# EAGLE design aufgeblasen-wurst (EAGLE 6.3)
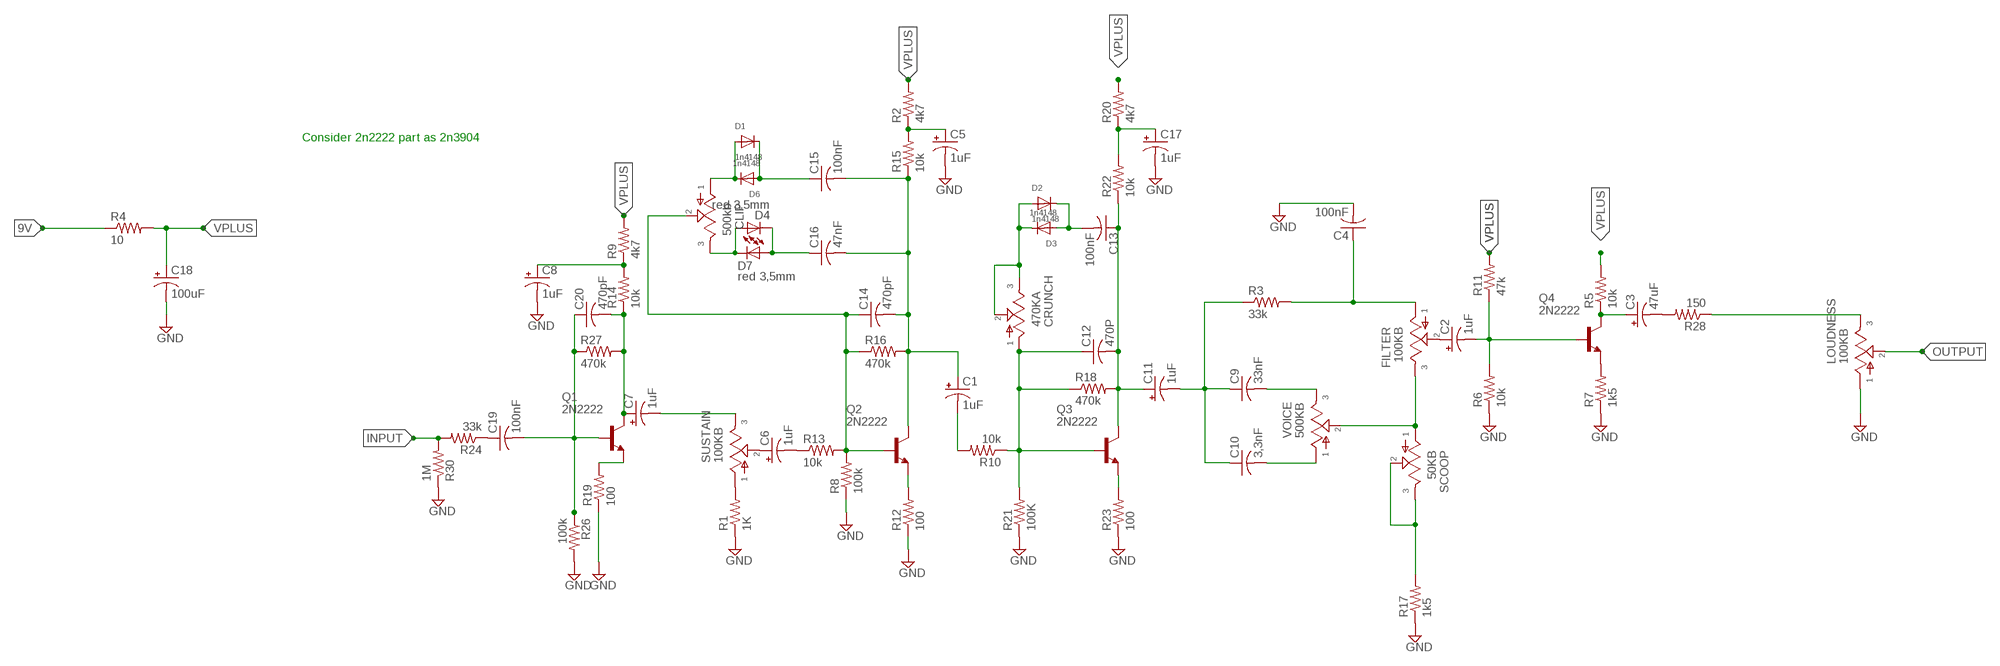
[diagram p0: schematic, sheet 1]

## Parts
C1  1uF  CPOL-USTT2D5  [TT2D5]
C2  1uF  CPOL-USTT2D5  [TT2D5]
C3  47uF  CPOL-USTT2D5  [TT2D5]
C4  100nF  C-US050-025X075  [C050-025X075]
C5  1uF  CPOL-USTT2D5  [TT2D5]
C6  1uF  CPOL-USTT2D5  [TT2D5]
C7  1uF  CPOL-USTT2D5  [TT2D5]
C8  1uF  CPOL-USTT2D5  [TT2D5]
C9  33nF  C-US050-025X075  [C050-025X075]
C10  3,3nF  C-US050-025X075  [C050-025X075]
C11  1uF  CPOL-USTT2D5  [TT2D5]
C12  470P  C-US050-025X075  [C050-025X075]
C13  100nF  C-US050-025X075  [C050-025X075]
C14  470pF  C-US050-025X075  [C050-025X075]
C15  100nF  C-US050-025X075  [C050-025X075]
C16  47nF  C-US050-025X075  [C050-025X075]
C17  1uF  CPOL-USTT2D5  [TT2D5]
C18  100uF  CPOL-USTT2D5  [TT2D5]
C19  100nF  C-US050-025X075  [C050-025X075]
C20  470pF  C-US050-025X075  [C050-025X075]
CLIP  500kb  POT  [POT]
CRUNCH  470KA  POT  [POT]
D1  1n4148  DIODEDO-1N4148  [DO-1N4148]
D2  1n4148  DIODEDO-1N4148  [DO-1N4148]
D3  1n4148  DIODEDO-1N4148  [DO-1N4148]
D4  red 3,5mm  LED3MM  [LED3MM]
D6  1n4148  DIODEDO-1N4148  [DO-1N4148]
D7  red 3,5mm  LED3MM  [LED3MM]
FILTER  100KB  POT  [POT]
LOUDNESS  100KB  POT  [POT]
Q1  2N2222  [TO92-EBC-OVAL]
Q2  2N2222  [TO92-EBC-OVAL]
Q3  2N2222  [TO92-EBC-OVAL]
Q4  2N2222  [TO92-EBC-OVAL]
R1  1K  R-US_0207/7  [0207/7]
R2  4k7  R-US_0207/7  [0207/7]
R3  33k  R-US_0207/7  [0207/7]
R4  10  R-US_0207/7  [0207/7]
R5  10k  R-US_0207/7  [0207/7]
R6  10k  R-US_0207/7  [0207/7]
R7  1k5  R-US_0207/7  [0207/7]
R8  100k  R-US_0207/7  [0207/7]
R9  4k7  R-US_0207/7  [0207/7]
R10  10k  R-US_0207/7  [0207/7]
R11  47k  R-US_0207/7  [0207/7]
R12  100  R-US_0207/7  [0207/7]
R13  10k  R-US_0207/7  [0207/7]
R14  10k  R-US_0207/7  [0207/7]
R15  10k  R-US_0207/7  [0207/7]
R16  470k  R-US_0207/7  [0207/7]
R17  1k5  R-US_0207/7  [0207/7]
R18  470k  R-US_0207/7  [0207/7]
R19  100  R-US_0207/7  [0207/7]
R20  4k7  R-US_0207/7  [0207/7]
R21  100K  R-US_0207/7  [0207/7]
R22  10k  R-US_0207/7  [0207/7]
R23  100  R-US_0207/7  [0207/7]
R24  33k  R-US_0207/7  [0207/7]
R26  100k  R-US_0207/7  [0207/7]
R27  470k  R-US_0207/7  [0207/7]
R28  150  R-US_0207/7  [0207/7]
R30  1M  R-US_0207/7  [0207/7]
SCOOP  50KB  POT  [POT]
SUSTAIN  100KB  POT  [POT]
VOICE  500KB  POT  [POT]

## Nets
9V: R4.1
GND: C4.2 C5.- C8.- C17.- C18.- LOUDNESS.1 R1.1 R6.1 R7.1 R8.1 R12.1 R17.1 R19.1 R21.1 R23.1 R26.2 R30.1
INPUT: R24.2 R30.2
JUMP1: LOUDNESS.3 R28.1
JUMP3: C14.1 CLIP.2 Q2.B R8.2 R13.2 R16.1
N$1: C19.2 C20.1 Q1.B R26.1 R27.1
N$2: C19.1 R24.1
N$3: Q1.E R19.2
N$4: C6.+ SUSTAIN.2
N$5: C7.- SUSTAIN.3
N$6: R1.2 SUSTAIN.1
N$7: C2.+ FILTER.2
N$8: C6.- R13.1
N$10: Q2.E R12.2
N$11: C1.+ C14.2 C15.2 C16.2 Q2.C R15.1 R16.2
N$12: CLIP.3 D4.A D7.K(C)
N$13: C8.+ R9.1 R14.2
N$14: C16.1 D4.K(C) D7.A
N$15: C15.1 D1.C D6.A
N$16: CLIP.1 D1.A D6.C
N$17: C5.+ R2.1 R15.2
N$18: C1.- R10.2
N$19: C11.+ C12.2 C13.1 Q3.C R18.2 R22.1
N$20: C12.1 CRUNCH.1 Q3.B R10.1 R18.1 R21.2
N$21: Q3.E R23.2
N$22: CRUNCH.2 CRUNCH.3 D2.A D3.C
N$23: C13.2 D2.C D3.A
N$24: C17.+ R20.1 R22.2
N$25: C9.1 C10.1 C11.- R3.1
N$26: C10.2 VOICE.1
N$27: C4.1 FILTER.1 R3.2
N$28: C9.2 VOICE.3
N$29: FILTER.3 SCOOP.1 VOICE.2
N$30: R17.2 SCOOP.2 SCOOP.3
N$32: C2.- Q4.B R6.2 R11.1
N$33: C3.+ Q4.C R5.1
N$34: Q4.E R7.2
N$35: C7.+ C20.2 Q1.C R14.1 R27.2
N$36: C3.- R28.2
OUTPUT: LOUDNESS.2
VPLUS: C18.+ R2.2 R4.2 R5.2 R9.2 R11.2 R20.2

## Notes on the sheet
- Consider 2n2222 part as 2n3904

## Library data of the parts
C1-C3 C5-C8 C11 C17 C18 = adafruit:CPOL-US: POLARIZED CAPACITOR, American symbol
C4 C9 C10 C12-C16 C19 C20 = adafruit:C-US: CAPACITOR, American symbol
CLIP CRUNCH FILTER LOUDNESS SCOOP SUSTAIN VOICE = gm-pots:POT: Potentiometers the arrow indicates the clockwise motion of th wiper (lug 2) fully counter clockwise there is no resistance between lugs 1 and 2 fully clockwise the resistance between lugs 1 and 2 is the value of the pot
D1-D3 D6 = adafruit:DIODE: Diode SMADIODE - SMA Surface Mount Package 20V 1A Schottky Diode Digikey: 641-1014-6-ND DO-1N4148 - Through Hole Small Current Diode SOD-123 20V 1 A (.5mV Vf) Schottky Diode - Digikey: MBRX120TPMSCT-ND SOD-323 10V 570mA (.38mV Vf, 3ns) Schottky Diode - Digikey: ZLLS410CT-ND SOD-523 30V 30mA Schottky Diode (RB751S-40TE61) - Digikey: RB751S-40TE61CT-ND SOT23-R/W - SOT23 Package (R = Solder Paste/Reflow Ovens, W = Hand-Soldering) BAT54Film 40V 300mA - Digikey: 497-7162-1-ND
D4 D7 = adafruit:LED: LED OSRAM: - CHIPLED LG R971, LG N971, LY N971, LG Q971, LY Q971, LO R971, LY R971 LH N974, LH R974 LS Q976, LO Q976, LY Q976 LO Q996 - Hyper CHIPLED LW Q18S LB Q993, LB Q99A, LB R99A - SideLED LS A670, LO A670, LY A670, LG A670, LP A670 LB A673, LV A673, LT A673, LW A673 LH A674 LY A675 LS A676, LA A676, LO A676, LY A676, LW A676 LS A679, LY A679, LG A679 - Hyper Micro SIDELED® LS Y876, LA Y876, LO Y876, LY Y876 LT Y87S - SmartLED LW L88C, LW L88S LB L89C, LB L89S, LG L890 LS L89K, LO L89K, LY L89K LS L896, LA L896, LO L896, LY L896 - TOPLED LS T670, LO T670, LY T670, LG T670, LP T670 LSG T670, LSP T670, LSY T670, LOP T670, LYG T670 LG T671, LOG T671, LSG T671 LB T673, LV T673, LT T673, LW T673 LH T674 LS T676, LA T676, LO T676, LY T676, LB T676, LH T676, LSB T676, LW T676 LB T67C, LV T67C, LT T67C, LS T67K, LO T67K, LY T67K, LW E67C LS E67B, LA E67B, LO E67B, LY E67B, LB E67C, LV E67C, LT E67C LW T67C LS T679, LY T679, LG T679 LS T770, LO T770, LY T770, LG T770, LP T770 LB T773, LV T773, LT T773, LW T773 LH T774 LS E675, LA E675, LY E675, LS T675 LS T776, LA T776, LO T776, LY T776, LB T776 LHGB T686 LT T68C, LB T68C - Hyper Mini TOPLED® LB M676 - Mini TOPLED Santana® LG M470 LS M47K, LO M47K, LY M47K Source: http://www.osram.convergy.de/
Q1-Q4 = adafruit:2N2222: NPN TRANSISTOR Big oval pads
R1-R24 R26-R28 R30 = rcl:R-US_: RESISTOR, American symbol

## Board
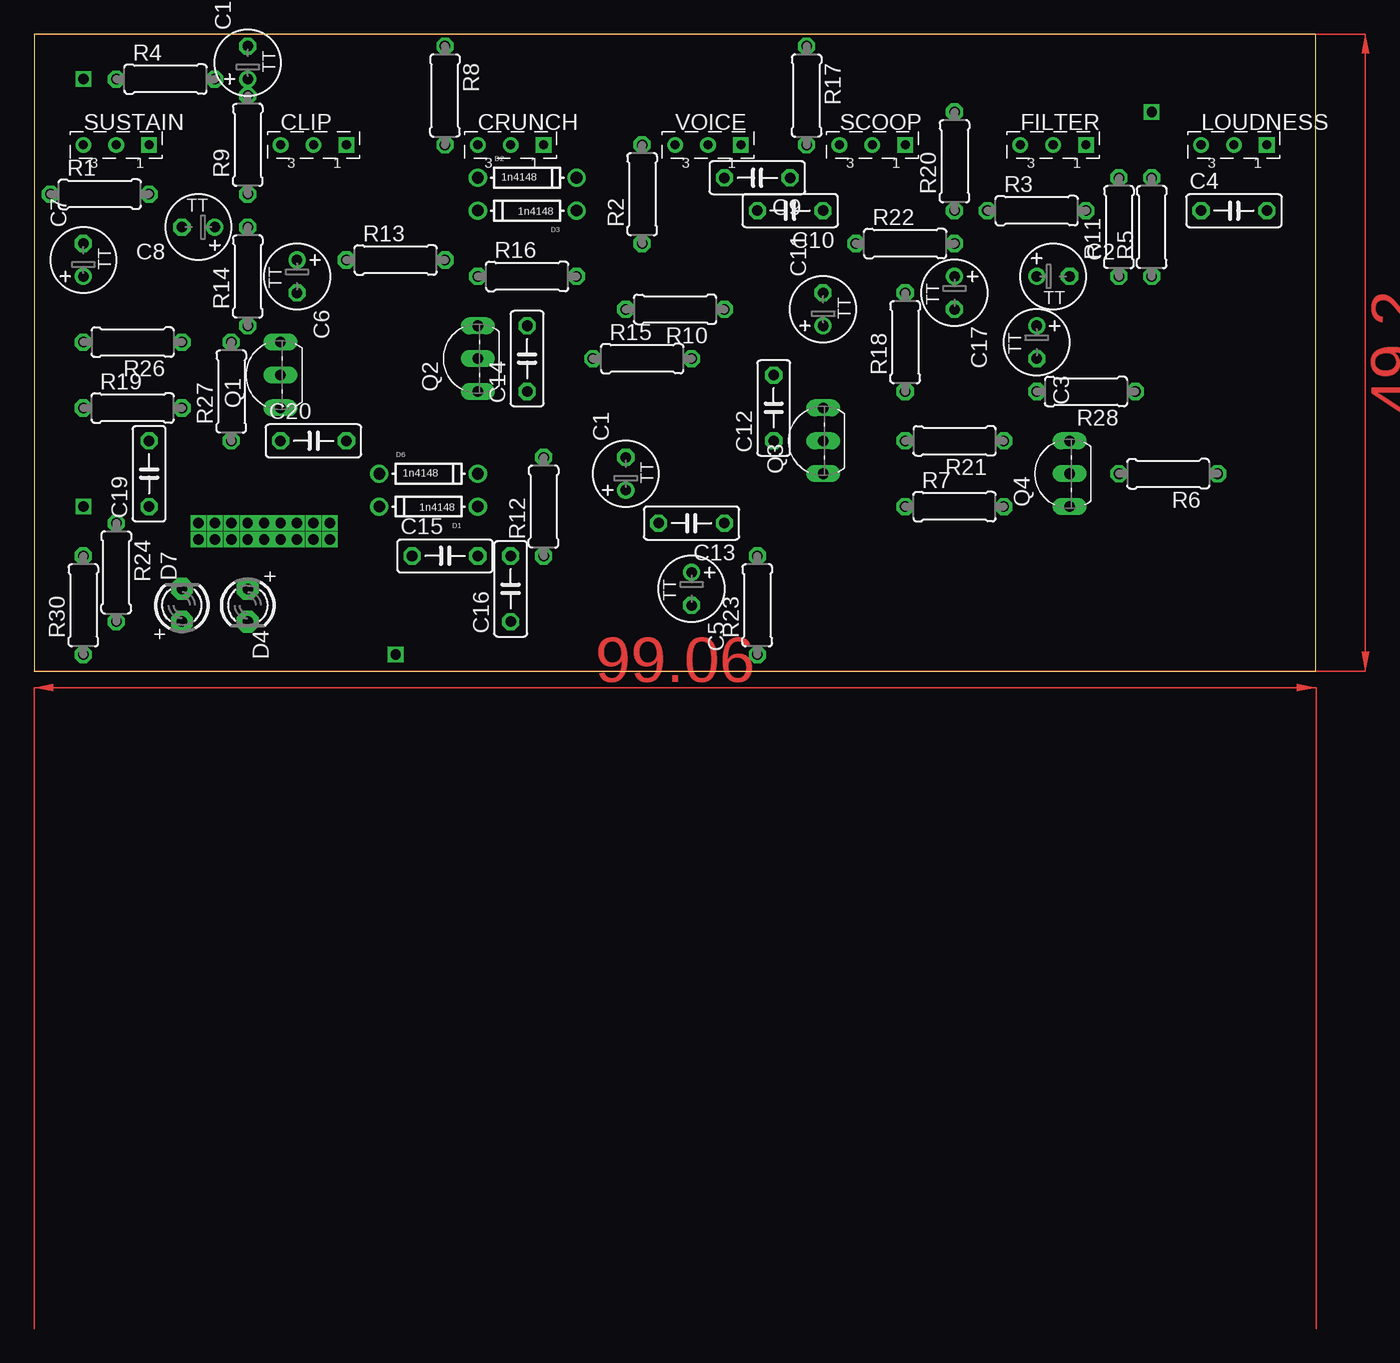
[diagram p1: board, top side]
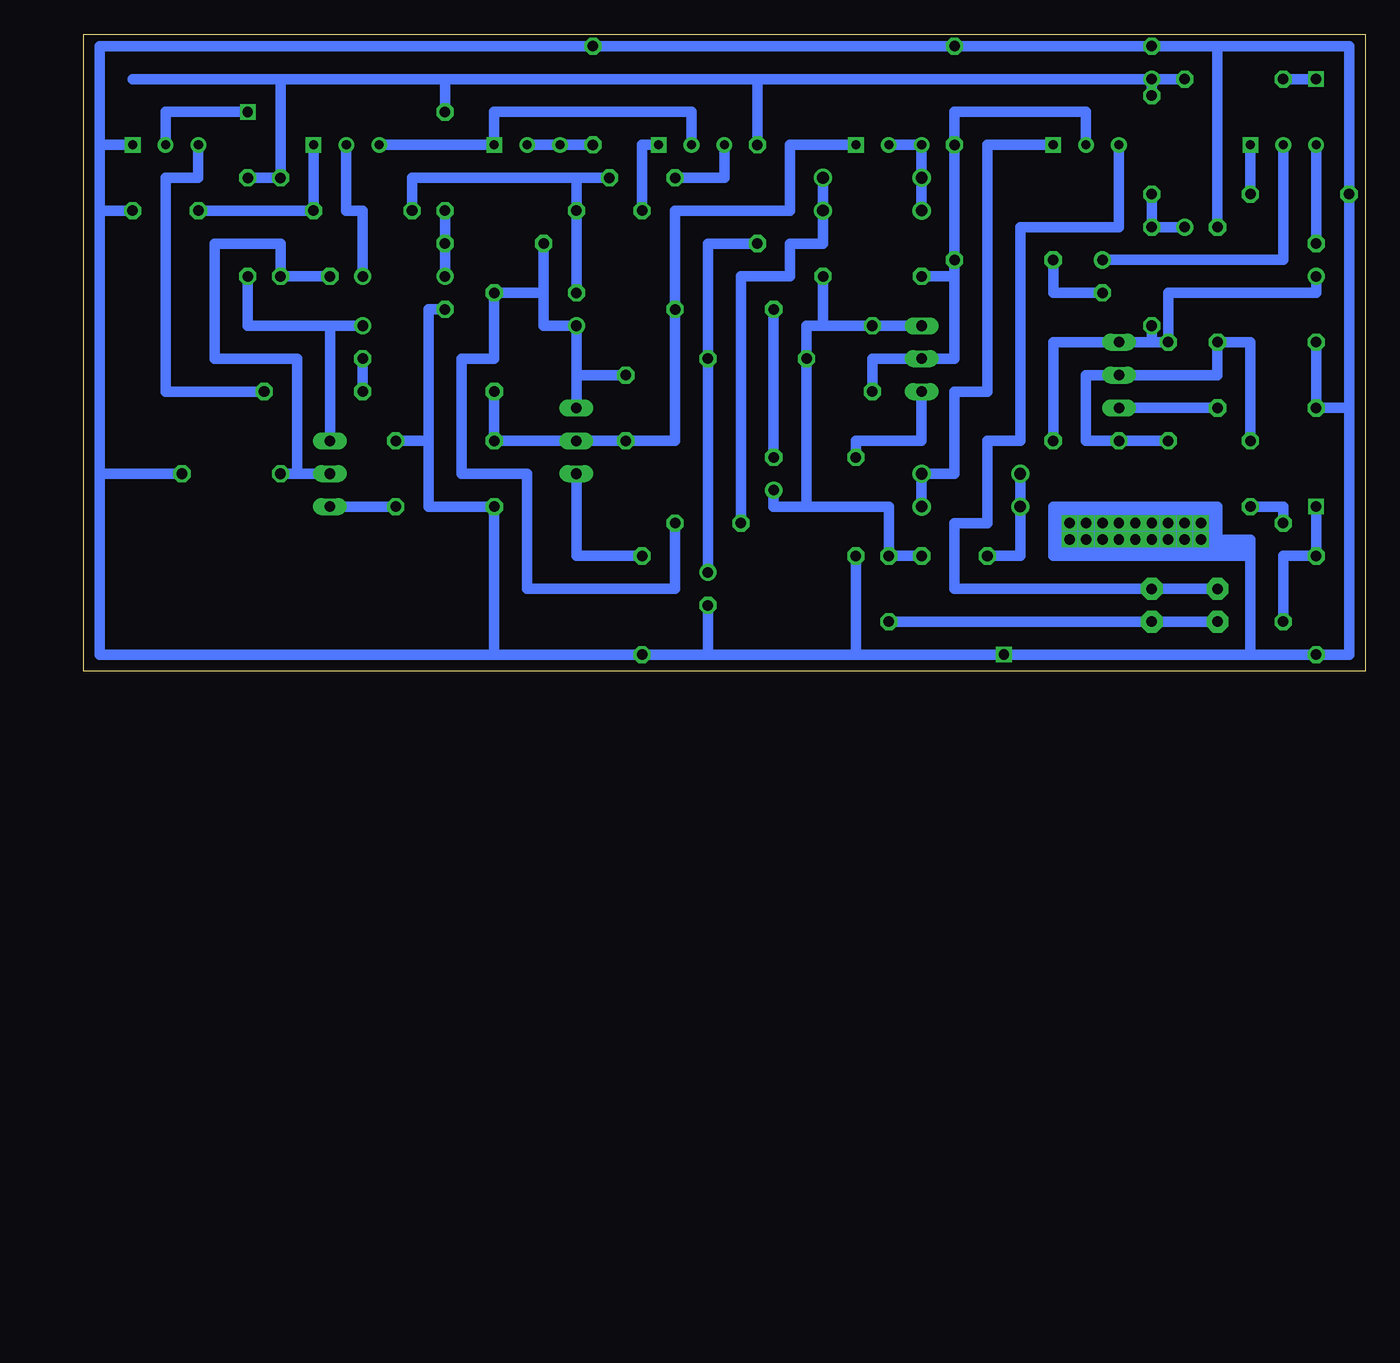
[diagram p2: board, bottom side, seen from below]

Size 99.04 x 49.2 mm. Coordinates in mm from the lower left corner, seen from the top.
Outline: 0,0 99.04,0 99.04,49.2 0,49.2 0,0
Copper layers (1*16): Top 0.035mm / dielectric 1.5mm / Bottom 0.035mm
Design rules "default": minimum track width 10mil, minimum drill 24mil, track to track 8mil, track to pad 8mil, pad to pad 8mil, via to via 8mil, smd to smd 8mil, copper to edge 40mil, drill to drill 8mil, minimum pad ring 10mil, minimum via ring 8mil, stop-mask expansion 4mil, vias tented up to drill 0mil, thermal gap 10mil

### Footprints (pad centres in the part's own frame; a part is rotated, then mirrored left to right if it is on the bottom)
TT2D5 = drill 0.813: + -1.27,0 | drill 0.813 octagon: - 1.27,0
C050-025X075 = drill 0.813 octagon: 1 -2.54,0; 2 2.54,0
POT = drill 0.7 square: 1 2.54,0 | drill 0.7: 2 0,0; 3 -2.54,0
DO-1N4148 = drill 0.9: A -3.81,0; C 3.81,0
LED3MM = drill 0.813 pad 1.676 octagon: A -1.27,0; K 1.27,0
TO92-EBC-OVAL = drill 0.813 long: B 0,-1.27; C 2.54,-1.27; E -2.54,-1.27
0207/7 = drill 0.813 octagon: 1 -3.81,0; 2 3.81,0

### Placement (x,y rotation side)
C1  45.72,15.24 90 top
C2  78.74,30.48 0 top
C3  77.47,25.4 270 top
C4  92.71,35.56 0 top
C5  50.8,6.35 270 top
C6  20.32,30.48 270 top
C7  3.81,31.75 90 top
C8  12.7,34.29 180 top
C9  55.88,38.1 180 top
C10  58.42,35.56 180 top
C11  60.96,27.94 90 top
C12  57.15,20.32 90 top
C13  50.8,11.43 180 top
C14  38.1,24.13 90 top
C15  31.75,8.89 0 top
C16  36.83,6.35 90 top
C17  71.12,29.21 270 top
C18  16.51,46.99 90 top
C19  8.89,15.24 90 top
C20  21.59,17.78 0 top
CLIP  21.59,40.64 0 top
CRUNCH  36.83,40.64 0 top
D1  30.48,12.7 180 top
D2  38.1,38.1 0 top
D3  38.1,35.56 180 top
D4  16.51,5.08 270 top
D6  30.48,15.24 0 top
D7  11.43,5.08 90 top
FILTER  78.74,40.64 0 top
LOUDNESS  92.71,40.64 0 top
Q1  17.78,22.86 90 top
Q2  33.02,24.13 90 top
Q3  59.69,17.78 90 top
Q4  78.74,15.24 90 top
R1  5.08,36.83 0 top
R2  46.99,36.83 90 top
R3  77.47,35.56 0 top
R4  10.16,45.72 0 top
R5  86.36,34.29 90 top
R6  87.63,15.24 180 top
R7  71.12,12.7 0 top
R8  31.75,44.45 270 top
R9  16.51,40.64 90 top
R10  49.53,27.94 180 top
R11  83.82,34.29 90 top
R12  39.37,12.7 90 top
R13  27.94,31.75 0 top
R14  16.51,30.48 90 top
R15  46.99,24.13 0 top
R16  38.1,30.48 0 top
R17  59.69,44.45 270 top
R18  67.31,25.4 90 top
R19  7.62,20.32 0 top
R20  71.12,39.37 90 top
R21  71.12,17.78 180 top
R22  67.31,33.02 0 top
R23  55.88,5.08 90 top
R24  6.35,7.62 270 top
R26  7.62,25.4 180 top
R27  15.24,21.59 90 top
R28  81.28,21.59 180 top
R30  3.81,5.08 90 top
SCOOP  64.77,40.64 0 top
SUSTAIN  6.35,40.64 0 top
VOICE  52.07,40.64 0 top

### Tracks (layer width: path | path; a pad name or v marks a point on that pad's centre or on a via)
9V  (via drill 0.8)
  Bottom 0.813: v3.81,45.72 R4.1
GND  (via drill 0.8)
  Bottom 0.813: 1.27,20.32 1.27,1.27 R30.1 8.89,1.27 | 1.27,20.32 R1.1 1.27,48.26 11.43,48.26 | 97.79,40.64 97.79,48.26 R17.1 R8.1 C18.- 11.43,48.26 | 97.79,40.64 97.79,35.56 | 97.79,35.56 97.79,15.24 | 97.79,15.24 97.79,1.27 67.31,1.27 | 50.8,1.27 39.37,1.27 | 39.37,1.27 v27.94,1.27 8.89,1.27 | 8.89,1.27 8.89,8.89 | 8.89,8.89 8.89,10.16 v12.7,10.16 v13.97,10.16 v15.24,10.16 v16.51,10.16 v17.78,10.16 v19.05,10.16 v20.32,10.16 v21.59,10.16 v22.86,10.16 24.13,10.16 | 8.89,8.89 11.43,8.89 | 11.43,8.89 24.13,8.89 24.13,12.7 11.43,12.7 11.43,8.89 | C4.2 97.79,35.56 | C5.- 50.8,1.27 | C8.- 11.43,48.26 | LOUDNESS.1 97.79,40.64 | R6.1 97.79,15.24 | 67.31,1.27 R7.1 72.39,12.7 72.39,17.78 | R12.1 39.37,1.27 | 1.27,20.32 R19.1 R26.2 | 72.39,17.78 72.39,27.94 C17.- | R21.1 72.39,17.78 | 67.31,1.27 R23.1 50.8,1.27
INPUT  (via drill 0.8)
  Bottom 0.813: v3.81,12.7 R30.2 6.35,8.89 R24.2
JUMP1
  Bottom 0.813: R28.1 92.71,21.59 92.71,38.1 90.17,38.1 LOUDNESS.3
JUMP3
  Bottom 0.813: C14.1 38.1,24.13 Q2.B 31.75,24.13 R13.2 | CLIP.2 21.59,43.18 31.75,43.18 R8.2 R13.2 | R16.1 31.75,30.48 R13.2
N$1
  Bottom 0.813: C19.2 8.89,25.4 R26.1 11.43,22.86 Q1.B 21.59,22.86 21.59,17.78 C20.1 R27.1
N$2
  Bottom 0.813: R24.1 6.35,12.7 C19.1
N$3
  Bottom 0.813: R19.2 Q1.E
N$4
  Bottom 0.813: SUSTAIN.2 6.35,31.75 C6.+
N$5
  Bottom 0.813: SUSTAIN.3 C7.-
N$6
  Bottom 0.813: SUSTAIN.1 R1.2
N$7
  Bottom 0.813: FILTER.2 78.74,35.56 77.47,35.56 C2.+
N$8
  Bottom 0.813: C6.- 24.13,29.21 R13.1
N$9  (via drill 0.8)
  other vias: 12.7,11.43
N$10
  Bottom 0.813: Q2.E 34.29,17.78 39.37,17.78 R12.2
N$11
  Bottom 0.813: C15.2 C16.2 36.83,12.7 43.18,12.7 | Q2.C C14.2 41.91,26.67 | 43.18,12.7 45.72,12.7 C1.+ | 43.18,12.7 R15.1 43.18,26.67 41.91,26.67 | R16.2 41.91,26.67
N$12
  Bottom 0.813: D7.K D4.A 31.75,6.35 31.75,11.43 29.21,11.43 29.21,17.78 26.67,17.78 26.67,34.29 19.05,34.29 CLIP.3
N$13
  Bottom 0.813: R9.1 R14.2 C8.+
N$14
  Bottom 0.813: D7.A D4.K C16.1
N$15
  Bottom 0.813: C15.1 26.67,8.89 D1.C D6.A
N$16
  Bottom 0.813: D1.A D6.C 31.75,15.24 31.75,21.59 29.21,21.59 29.21,40.64 CLIP.1
N$17
  Bottom 0.813: R2.1 50.8,33.02 R15.2 C5.+
N$18
  Bottom 0.813: R10.2 C1.-
N$19
  Bottom 0.813: Q3.C 60.96,22.86 | 60.96,22.86 C11.+ 63.5,26.67 63.5,29.21 | C12.2 60.96,22.86 | C13.1 53.34,6.35 64.77,6.35 64.77,15.24 69.85,15.24 69.85,24.13 67.31,24.13 R18.2 63.5,29.21 | R22.1 63.5,29.21
N$20
  Bottom 0.813: CRUNCH.1 44.45,40.64 44.45,35.56 53.34,35.56 R10.1 53.34,17.78 C12.1 Q3.B R21.2 R18.1
N$21
  Bottom 0.813: R23.2 60.96,8.89 Q3.E
N$22
  Bottom 0.813: D3.C D2.A CRUNCH.3 CRUNCH.2
N$23
  Bottom 0.813: D2.C D3.A 41.91,33.02 44.45,33.02 44.45,30.48 48.26,30.48 C13.2
N$24
  Bottom 0.813: R20.1 R22.2 C17.+
N$25
  Bottom 0.813: R3.1 73.66,38.1 60.96,38.1 | C11.- C10.1 60.96,38.1 | C9.1 60.96,38.1
N$26
  Bottom 0.813: VOICE.1 55.88,40.64 C10.2
N$27
  Bottom 0.813: FILTER.1 R3.2 C4.1
N$28
  Bottom 0.813: VOICE.3 49.53,38.1 C9.2
N$29
  Bottom 0.813: FILTER.3 SCOOP.1 67.31,43.18 52.07,43.18 VOICE.2
N$30
  Bottom 0.813: SCOOP.2 SCOOP.3 R17.2
N$31  (via drill 0.8)
  other vias: 16.51,11.43
N$32
  Bottom 0.813: C2.- R11.1 83.82,33.02 88.9,33.02 88.9,24.13 82.55,24.13 82.55,15.24 R6.2 Q4.B
N$33
  Bottom 0.813: Q4.C 80.01,26.67 C3.+ 86.36,26.67 R5.1
N$34
  Bottom 0.813: R7.2 Q4.E
N$35
  Bottom 0.813: C20.2 24.13,25.4 Q1.C 16.51,25.4 | 16.51,25.4 R27.2 15.24,29.21 3.81,29.21 C7.+ | R14.1 16.51,25.4
N$36
  Bottom 0.813: C3.- R28.2
N$37  (via drill 0.8)
  other vias: 20.32,11.43
N$38  (via drill 0.8)
  other vias: 22.86,11.43
N$39  (via drill 0.8)
  other vias: 17.78,11.43
N$40  (via drill 0.8)
  other vias: 15.24,11.43
N$41  (via drill 0.8)
  other vias: 13.97,11.43
N$42  (via drill 0.8)
  other vias: 19.05,11.43
N$43  (via drill 0.8)
  other vias: 21.59,11.43
OUTPUT  (via drill 0.8)
  Bottom 0.813: v86.36,43.18 92.71,43.18 LOUDNESS.2
VPLUS
  Bottom 0.813: 83.82,45.72 95.25,45.72 | 83.82,45.72 71.12,45.72 | 71.12,45.72 46.99,45.72 | R2.2 46.99,45.72 | R4.2 C18.+ | C18.+ 46.99,45.72 | C18.+ R9.2 | R5.2 R11.2 83.82,45.72 | R20.2 71.12,45.72
(copper drawn outside any net)
  shapes: Bottom area x2, Top area x2